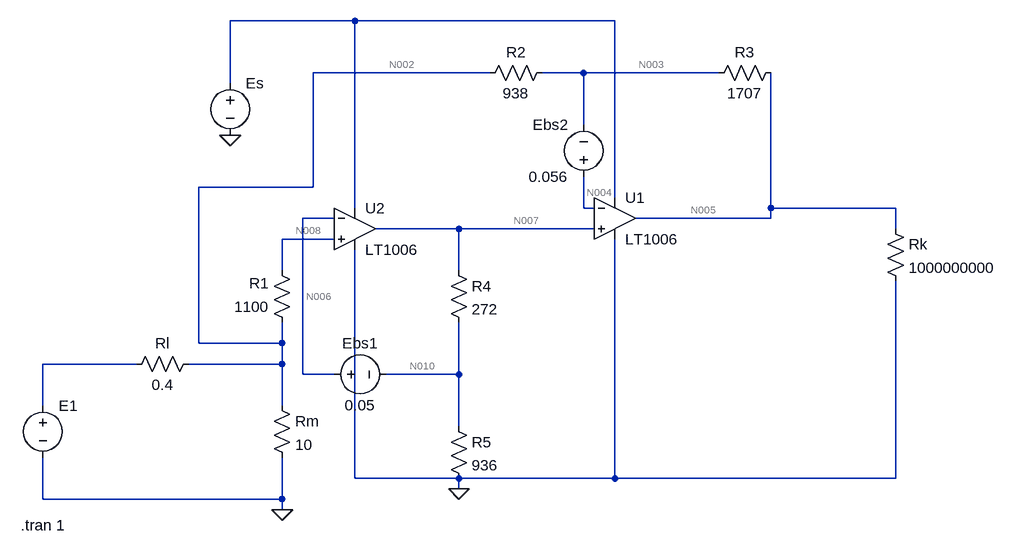
[diagram p0: schematic Draft4.asc]
Draft4.asc, the LTspice schematic file:
Version 4
SHEET 1 1304 776
WIRE 304 -16 112 -16
WIRE 704 -16 304 -16
WIRE 512 64 240 64
WIRE 656 64 592 64
WIRE 864 64 656 64
WIRE 112 80 112 -16
WIRE 656 144 656 64
WIRE 240 240 240 64
WIRE 240 240 64 240
WIRE 704 256 704 -16
WIRE 304 272 304 -16
WIRE 656 272 656 224
WIRE 672 272 656 272
WIRE 944 272 944 64
WIRE 1136 272 944 272
WIRE 272 288 224 288
WIRE 944 288 944 272
WIRE 944 288 736 288
WIRE 464 304 336 304
WIRE 672 304 464 304
WIRE 1136 304 1136 272
WIRE 272 320 192 320
WIRE 192 368 192 320
WIRE 464 368 464 304
WIRE 64 480 64 240
WIRE 192 480 192 448
WIRE 192 480 64 480
WIRE -32 512 -176 512
WIRE 192 512 192 480
WIRE 192 512 48 512
WIRE 224 528 224 288
WIRE 272 528 224 528
WIRE 464 528 464 448
WIRE 464 528 352 528
WIRE -176 576 -176 512
WIRE 192 576 192 512
WIRE 464 608 464 528
WIRE 304 688 304 336
WIRE 464 688 304 688
WIRE 704 688 704 320
WIRE 704 688 464 688
WIRE 1136 688 1136 384
WIRE 1136 688 704 688
WIRE 464 704 464 688
WIRE -176 720 -176 656
WIRE 192 720 192 656
WIRE 192 720 -176 720
WIRE 192 736 192 720
FLAG 464 704 0
FLAG 192 736 0
FLAG 112 160 0
SYMBOL voltage 112 64 R0
SYMATTR InstName Es
SYMATTR Value ""
SYMBOL res 608 48 R90
WINDOW 0 0 56 VBottom 2
WINDOW 3 32 56 VTop 2
SYMATTR InstName R2
SYMATTR Value 938
SYMBOL res 960 48 R90
WINDOW 0 0 56 VBottom 2
WINDOW 3 32 56 VTop 2
SYMATTR InstName R3
SYMATTR Value 1707
SYMBOL lib\\sym\\Opamps\\LT1006 704 224 R0
SYMATTR InstName U1
SYMBOL voltage 656 240 R180
WINDOW 0 24 96 Left 2
WINDOW 3 24 16 Left 2
SYMATTR InstName Ebs2
SYMATTR Value 0.056
SYMBOL lib\\sym\\Opamps\\LT1006 304 240 R0
SYMATTR InstName U2
SYMBOL res 176 560 R0
SYMATTR InstName Rm
SYMATTR Value 10
SYMBOL res 64 496 R90
WINDOW 0 0 56 VBottom 2
WINDOW 3 32 56 VTop 2
SYMATTR InstName Rl
SYMATTR Value 0.4
SYMBOL res 208 464 R180
WINDOW 0 36 76 Left 2
WINDOW 3 36 40 Left 2
SYMATTR InstName R1
SYMATTR Value 1100
SYMBOL voltage 256 528 R270
WINDOW 0 32 56 VTop 2
WINDOW 3 -32 56 VBottom 2
SYMATTR InstName Ebs1
SYMATTR Value 0.05
SYMBOL res 448 352 R0
SYMATTR InstName R4
SYMATTR Value 272
SYMBOL res 448 592 R0
SYMATTR InstName R5
SYMATTR Value 936
SYMBOL res 1120 288 R0
SYMATTR InstName Rk
SYMATTR Value 1000000000
SYMBOL voltage -176 560 R0
SYMATTR InstName E1
SYMATTR Value ""
TEXT -210 760 Left 2 !.tran 1

The netlist it stands for:
* Draft4.asc
V§Es N001 0
R2 N003 N002 938
R3 N005 N003 1707
XU1 N007 N004 N001 0 N005 LT1006  ; pins In+ In- V+ V- OUT
V§Ebs2 N004 N003 0.056
XU2 N008 N006 N001 0 N007 LT1006  ; pins In+ In- V+ V- OUT
Rm N002 0 10
Rl N002 N009 0.4
R1 N002 N008 1100
V§Ebs1 N006 N010 0.05
R4 N007 N010 272
R5 N010 0 936
Rk N005 0 1000000000
V§E1 N009 0
.tran 1
.lib LTC.lib
.backanno
.end

* Results of the author's LTspice run, read from the files saved beside the schematic
* Operating Point, zero values left out:
*   V(n003) = -10.59 µV
*   V(n002) = -4.296 nV
*   V(n005) = -312.7 nV
*   V(n004) = 55.99 mV
*   V(n007) = -550.8 nV
*   V(n006) = 50 mV
*   V(n008) = 127.6 nV
*   V(n010) = -3.474 µV
*   I(R5) = -3.711 nA
*   I(R4) = 10.75 nA
*   I(R1) = -119.9 pA
*   I(Rl) = -10.74 nA
*   I(Rm) = -429.6 pA
*   I(R3) = 6.023 nA
*   I(R2) = -11.29 nA
*   I(E1) = -10.74 nA
*   I(Ebs1) = -14.46 nA
*   I(Ebs2) = -17.31 nA
*   I(Es) = 449.4 µA
*   Ix(u1:1) = -134.4 pA
*   Ix(u1:2) = 17.31 nA
*   Ix(u1:3) = -224.7 µA
*   Ix(u1:4) = 223.3 µA
*   Ix(u1:5) = -6.023 nA
*   Ix(u2:1) = -119.9 pA
*   Ix(u2:2) = 14.46 nA
*   Ix(u2:3) = -224.7 µA
*   Ix(u2:4) = 223.3 µA
*   Ix(u2:5) = -10.61 nA